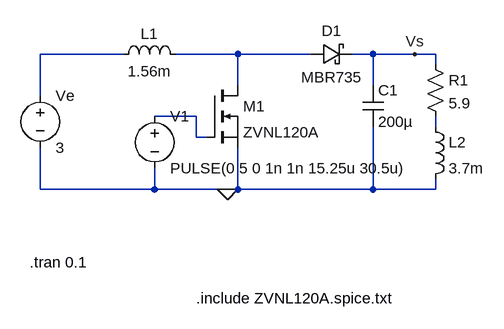
[diagram p0: schematic Designing of boost converter.asc]
Designing of boost converter.asc, the LTspice schematic file:
Version 4
SHEET 1 976 680
WIRE 16 64 -112 64
WIRE 192 64 96 64
WIRE 304 64 192 64
WIRE 400 64 368 64
WIRE 464 64 400 64
WIRE 496 64 464 64
WIRE 496 80 496 64
WIRE 192 112 192 64
WIRE 400 112 400 64
WIRE -112 128 -112 64
WIRE 128 160 64 160
WIRE 496 176 496 160
WIRE 128 192 128 160
WIRE 144 192 128 192
WIRE -112 272 -112 208
WIRE 64 272 64 240
WIRE 64 272 -112 272
WIRE 176 272 64 272
WIRE 192 272 192 208
WIRE 192 272 176 272
WIRE 400 272 400 176
WIRE 400 272 192 272
WIRE 496 272 496 256
WIRE 496 272 400 272
FLAG 176 272 0
FLAG 464 64 Vs
SYMBOL cap 384 112 R0
SYMATTR InstName C1
SYMATTR Value 200µ
SYMBOL res 480 64 R0
SYMATTR InstName R1
SYMATTR Value 5.9
SYMBOL voltage -112 112 R0
WINDOW 123 0 0 Left 0
WINDOW 39 0 0 Left 0
SYMATTR InstName Ve
SYMATTR Value 3
SYMBOL voltage 64 144 R0
WINDOW 123 0 0 Left 0
WINDOW 39 0 0 Left 0
SYMATTR InstName V1
SYMATTR Value PULSE(0 5 0 1n 1n 15.25u 30.5u)
SYMBOL ind 480 160 R0
SYMATTR InstName L2
SYMATTR Value 3.7m
SYMBOL schottky 304 80 R270
WINDOW 0 36 32 VTop 2
WINDOW 3 -4 32 VBottom 2
SYMATTR InstName D1
SYMATTR Value MBR735
SYMATTR Description Zener Diode
SYMATTR Type zener
SYMBOL nmos 144 112 R0
SYMATTR InstName M1
SYMATTR Value ZVNL120A
SYMATTR Prefix X
SYMBOL ind 0 80 R270
WINDOW 0 32 56 VTop 2
WINDOW 3 5 56 VBottom 2
SYMATTR InstName L1
SYMATTR Value 1.56m
TEXT 128 440 Left 2 !.include ZVNL120A.spice.txt
TEXT -128 384 Left 2 !.tran 0.1

The netlist it stands for:
* Designing of boost converter.asc
C1 Vs 0 200µ
R1 Vs N004 5.9
Ve N001 0 3
V1 N003 0 PULSE(0 5 0 1n 1n 15.25u 30.5u)
L2 N004 0 3.7m
D1 N002 Vs MBR735
XM1 N002 N003 0 ZVNL120A  ; pins D G S
L1 N001 N002 1.56m
.model D D
.lib standard.dio
.include ZVNL120A.spice.txt
.tran 0.1
.backanno
.end